# EAGLE design rc28c64rom (EAGLE 9.6.2)
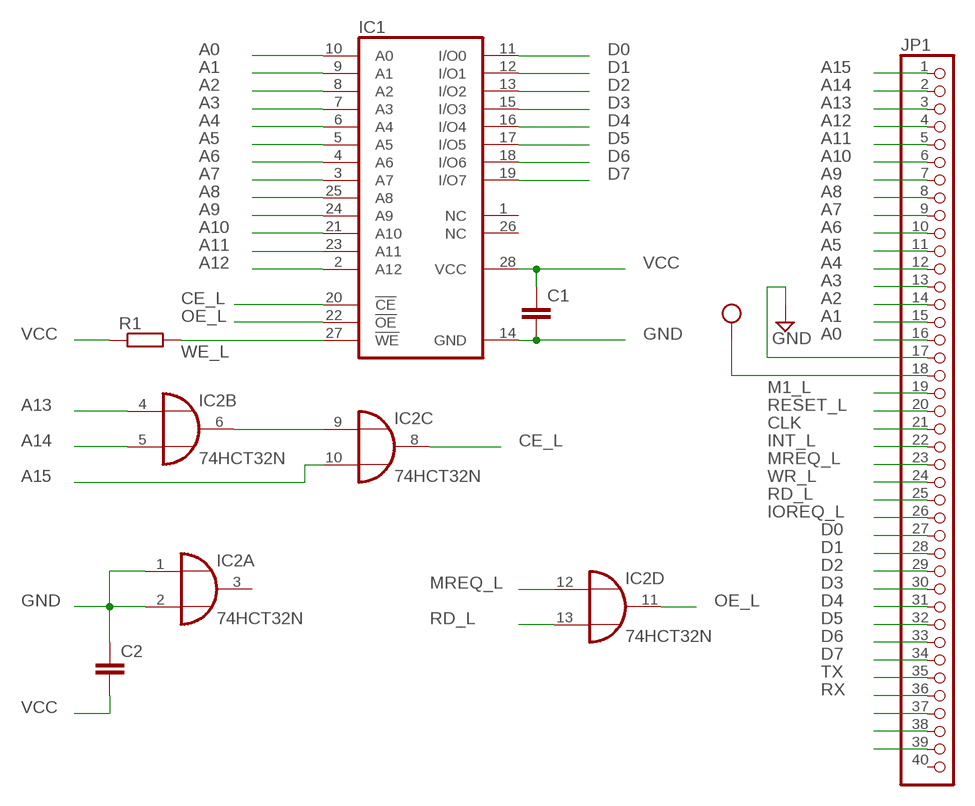
[diagram p0: schematic, sheet 1]

## Parts
C1  C-EU025-025X050  [C025-025X050]
C2  C-EU025-025X050  [C025-025X050]
IC1  28C64C  [DIL28-6]
IC2  74HCT32N  [DIL14]
JP1  PINHD-1X40  [1X40]
R1  R-EU_0204/7  [0204/7]

## Nets
A0: IC1.10(A0) JP1.16
A1: IC1.9(A1) JP1.15
A2: IC1.8(A2) JP1.14
A3: IC1.7(A3) JP1.13
A4: IC1.6(A4) JP1.12
A5: IC1.5(A5) JP1.11
A6: IC1.4(A6) JP1.10
A7: IC1.3(A7) JP1.9
A8: IC1.25(A8) JP1.8
A9: IC1.24(A9) JP1.7
A10: IC1.21(A10) JP1.6
A11: IC1.23(A11) JP1.5
A12: IC1.2(A12) JP1.4
A13: IC2.4(B:I0) JP1.3
A14: IC2.5(B:I1) JP1.2
A15: IC2.10(C:I1) JP1.1
CE_L: IC1.20(!CE) IC2.8(C:O)
CLK: JP1.21
D0: IC1.11(I/O0) JP1.27
D1: IC1.12(I/O1) JP1.28
D2: IC1.13(I/O2) JP1.29
D3: IC1.15(I/O3) JP1.30
D4: IC1.16(I/O4) JP1.31
D5: IC1.17(I/O5) JP1.32
D6: IC1.18(I/O6) JP1.33
D7: IC1.19(I/O7) JP1.34
GND: C1.2 C2.1 IC1.14(GND) IC2.1(A:I0) IC2.2(A:I1) JP1.17
INT_L: JP1.22
IOREQ_L: JP1.26
M1_L: JP1.19
MREQ_L: IC2.12(D:I0) JP1.23
N$1: JP1.37
N$2: JP1.38
N$3: JP1.39
N$4: IC2.6(B:O) IC2.9(C:I0)
OE_L: IC1.22(!OE) IC2.11(D:O)
RD_L: IC2.13(D:I1) JP1.25
RESET_L: JP1.20
RX: JP1.36
TX: JP1.35
VCC: C1.1 C2.2 IC1.28(VCC) JP1.18 R1.1
WE_L: IC1.27(!WE) R1.2
WR_L: JP1.24
Unconnected: IC1.1(NC) IC1.26(NC) IC2.3(A:O) JP1.40

## Power pins joined to a net without a drawn wire
GND: IC2.7(P:GND)
VCC: IC2.14(P:VCC)

## Library data of the parts
C1 C2 = rcl:C-EU: CAPACITOR, European symbol; SPICEPREFIX: C
IC1 = memory-nec:28C64C: MEMORY; MPN: AT28C64B-15PU; OC_FARNELL: 1095784; OC_NEWARK: 96K6557
IC2 = 74xx-eu:74*32: Quad 2-input OR gate
JP1 = pinhead:PINHD-1X40: PIN HEADER
R1 = rcl:R-EU_: RESISTOR, European symbol; SPICEPREFIX: R

## Board
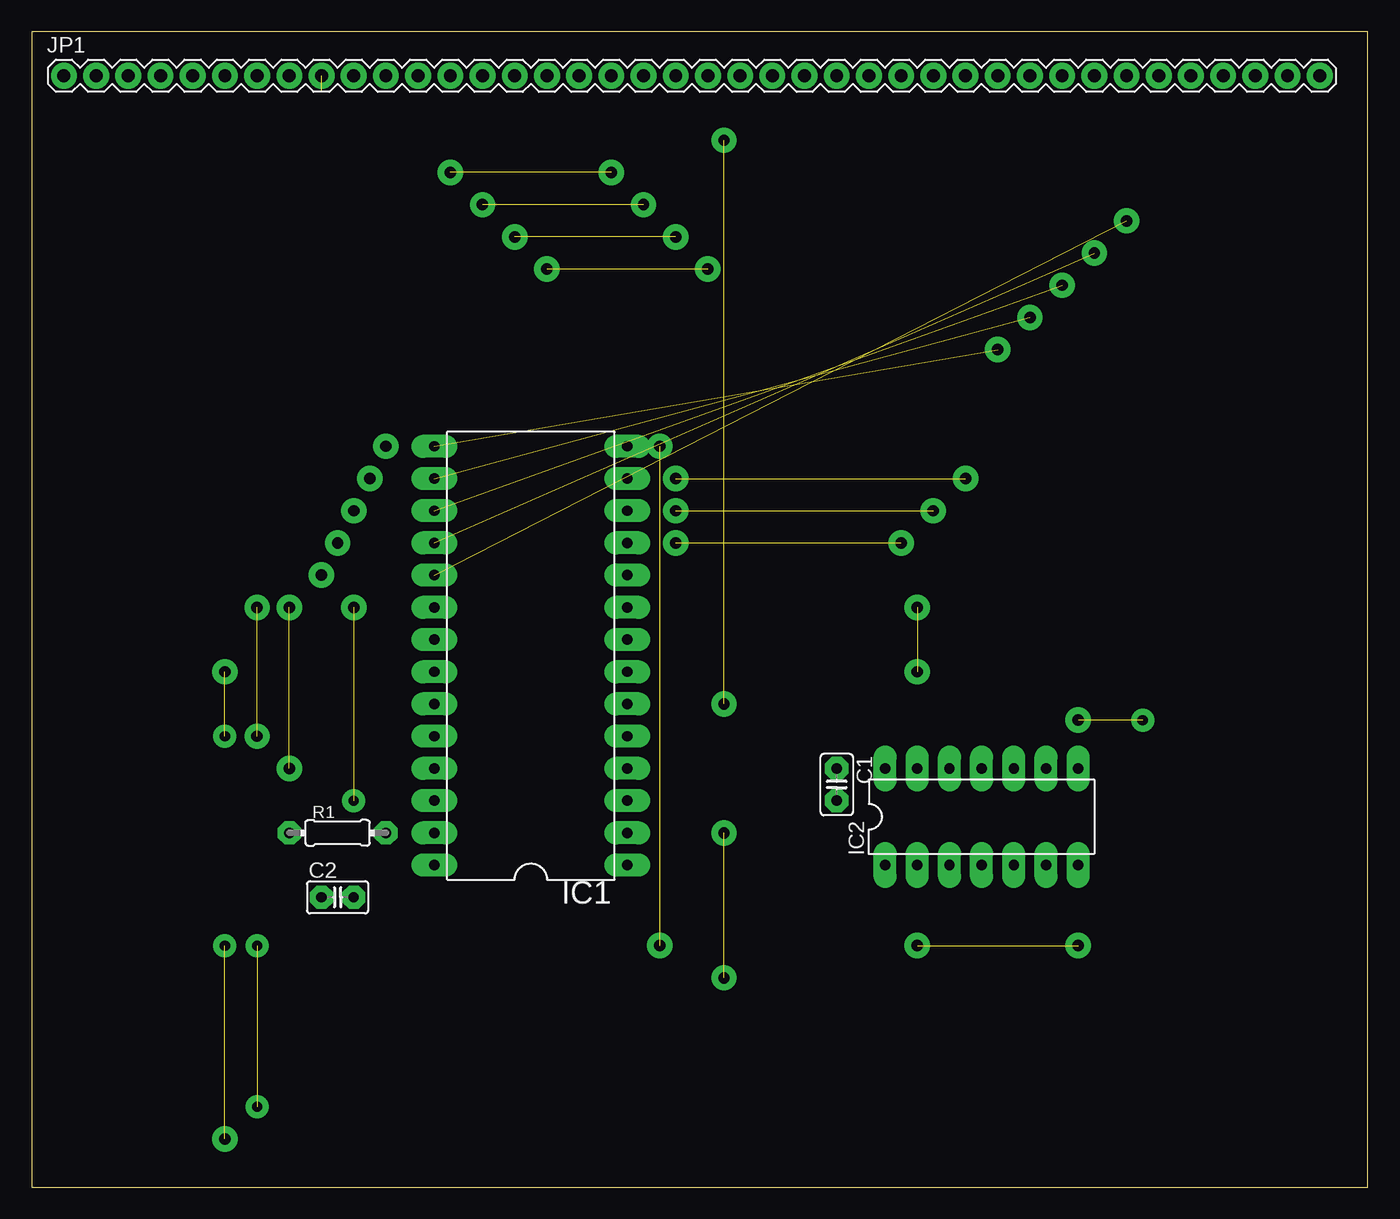
[diagram p1: board, top side]
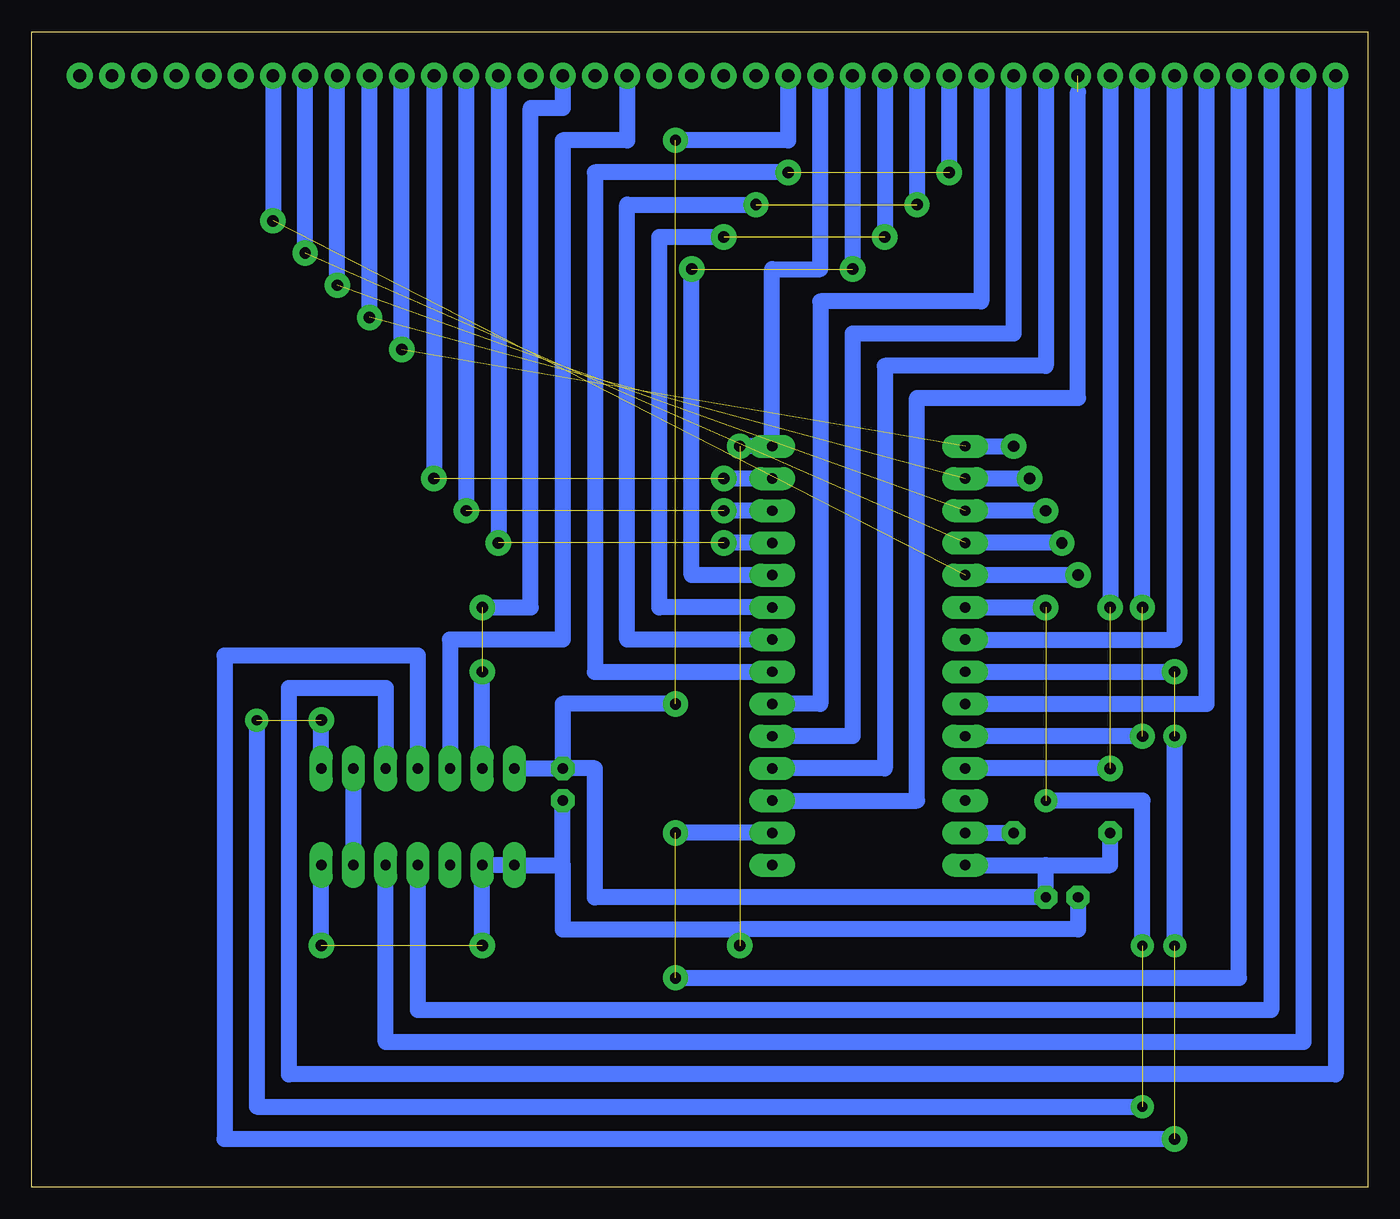
[diagram p2: board, bottom side, seen from below]

Size 105.39 x 91.11 mm. Coordinates in mm from the lower left corner, seen from the top.
Outline: 0,0 105.39,0 105.39,91.11 0,91.11 0,0
Copper layers (1*16): Top 0.035mm / dielectric 1.5mm / Bottom 0.035mm
Design rules "LabE": minimum track width 50mil, minimum drill 0.8mm, track to track 16mil, track to pad 16mil, pad to pad 16mil, via to via 16mil, smd to smd 16mil, copper to edge 0mil, drill to drill 16mil, minimum pad ring 20mil, minimum via ring 20mil, stop-mask expansion 4mil, vias tented up to drill 0mil, thermal gap 10mil

### Footprints (pad centres in the part's own frame; a part is rotated, then mirrored left to right if it is on the bottom)
C025-025X050 = drill 0.813 octagon: 1 -1.27,0; 2 1.27,0
DIL28-6 = drill 0.813 long: 1 -16.51,-7.62; 2 -13.97,-7.62; 3 -11.43,-7.62; 4 -8.89,-7.62; 5 -6.35,-7.62; 6 -3.81,-7.62; 7 -1.27,-7.62; 8 1.27,-7.62; 9 3.81,-7.62; 10 6.35,-7.62; 11 8.89,-7.62; 12 11.43,-7.62; 13 13.97,-7.62; 14 16.51,-7.62; 15 16.51,7.62; 16 13.97,7.62; 17 11.43,7.62; 18 8.89,7.62; 19 6.35,7.62; 20 3.81,7.62; 21 1.27,7.62; 22 -1.27,7.62; 23 -3.81,7.62; 24 -6.35,7.62; 25 -8.89,7.62; 26 -11.43,7.62; 27 -13.97,7.62; 28 -16.51,7.62
DIL14 = drill 0.813 long: 1 -7.62,-3.81; 2 -5.08,-3.81; 3 -2.54,-3.81; 4 0,-3.81; 5 2.54,-3.81; 6 5.08,-3.81; 7 7.62,-3.81; 8 7.62,3.81; 9 5.08,3.81; 10 2.54,3.81; 11 0,3.81; 12 -2.54,3.81; 13 -5.08,3.81; 14 -7.62,3.81
1X40 = drill 1.016: 1 -49.53,0; 2 -46.99,0; 3 -44.45,0; 4 -41.91,0; 5 -39.37,0; 6 -36.83,0; 7 -34.29,0; 8 -31.75,0; 9 -29.21,0; 10 -26.67,0; 11 -24.13,0; 12 -21.59,0; 13 -19.05,0; 14 -16.51,0; 15 -13.97,0; 16 -11.43,0; 17 -8.89,0; 18 -6.35,0; 19 -3.81,0; 20 -1.27,0; 21 1.27,0; 22 3.81,0; 23 6.35,0; 24 8.89,0; 25 11.43,0; 26 13.97,0; 27 16.51,0; 28 19.05,0; 29 21.59,0; 30 24.13,0; 31 26.67,0; 32 29.21,0; 33 31.75,0; 34 34.29,0; 35 36.83,0; 36 39.37,0; 37 41.91,0; 38 44.45,0; 39 46.99,0; 40 49.53,0
0204/7 = drill 0.813 octagon: 1 -3.81,0; 2 3.81,0

### Placement (x,y rotation side)
C1  63.5,31.75 270 top
C2  24.13,22.86 0 top
IC1  39.37,41.91 90 top
IC2  74.93,29.21 0 top
JP1  52.07,87.63 0 top
R1  24.13,27.94 0 top

### Tracks (layer width: path | path; a pad name or v marks a point on that pad's centre or on a via)
A0  (via drill 0.9 pad 2)  (1 unrouted)
  Bottom 1.27: JP1.16 v40.64,72.39 | IC1.10 53.34,48.26 v53.34,72.39
A1  (via drill 0.9 pad 2)  (1 unrouted)
  Bottom 1.27: JP1.15 v38.1,74.93 | IC1.9 55.88,45.72 55.88,74.93 v50.8,74.93
A2  (via drill 0.9 pad 2)  (1 unrouted)
  Bottom 1.27: JP1.14 v35.56,77.47 | IC1.8 58.42,43.18 58.42,77.47 v48.26,77.47
A3  (via drill 0.9 pad 2)  (1 unrouted)
  Bottom 1.27: v33.02,80.01 JP1.13 | v45.72,80.01 60.96,80.01 60.96,40.64 IC1.7
A4
  Bottom 1.27: JP1.12 30.48,69.85 43.18,69.85 43.18,38.1 IC1.6
A5
  Bottom 1.27: JP1.11 27.94,67.31 40.64,67.31 40.64,35.56 IC1.5
A6
  Bottom 1.27: JP1.10 25.4,64.77 38.1,64.77 38.1,33.02 IC1.4
A7  (1 unrouted)
  Bottom 1.27: IC1.3 35.56,30.48 35.56,62.23 22.86,62.23 22.86,86.36
A8  (via drill 0.9 pad 2)  (1 unrouted)
  Bottom 1.27: JP1.8 v20.32,45.72 | v20.32,33.02 IC1.25
A9  (via drill 0.9 pad 2)  (1 unrouted)
  Bottom 1.27: v17.78,45.72 JP1.7 | v17.78,35.56 IC1.24
A10
  Bottom 1.27: JP1.6 15.24,43.18 IC1.21
A11
  Bottom 1.27: JP1.5 12.7,38.1 IC1.23
A12  (via drill 0.9 pad 2)  (1 unrouted)
  Bottom 1.27: JP1.4 10.16,16.51 v54.61,16.51 | IC1.2 v54.61,27.94
A13
  Bottom 1.27: JP1.3 7.62,13.97 74.93,13.97 IC2.4
A14
  Bottom 1.27: JP1.2 5.08,11.43 77.47,11.43 IC2.5
A15
  Bottom 1.27: IC2.10 77.47,39.37 85.09,39.37 85.09,8.89 2.54,8.89 JP1.1
CE_L  (via drill 0.8, 0.9 pad 2)  (3 unrouted)
  Bottom 1.27: IC2.8 v82.55,36.83 | IC1.20 v25.4,45.72 | v87.63,36.83 87.63,6.35 v17.78,6.35 | v17.78,19.05 17.78,30.48 v25.4,30.48
D0  (via drill 0.9 pad 2)  (1 unrouted)
  Bottom 1.27: JP1.27 v68.58,50.8 | IC1.11 v50.8,50.8
D1  (via drill 0.9 pad 2)  (1 unrouted)
  Bottom 1.27: JP1.28 v71.12,53.34 | IC1.12 v50.8,53.34
D2  (via drill 0.9 pad 2)  (1 unrouted)
  Bottom 1.27: JP1.29 v73.66,55.88 | IC1.13 v50.8,55.88
D3  (via drill 0.9 pad 2)  (1 unrouted)
  Bottom 1.27: IC1.15 v27.94,58.42 | v76.2,66.04 JP1.30
D4  (via drill 0.9 pad 2)  (1 unrouted)
  Bottom 1.27: v26.67,55.88 IC1.16 | v78.74,68.58 JP1.31
D5  (via drill 0.9 pad 2)  (1 unrouted)
  Bottom 1.27: v25.4,53.34 IC1.17 | v81.28,71.12 JP1.32
D6  (via drill 0.9 pad 2)  (1 unrouted)
  Bottom 1.27: v24.13,50.8 IC1.18 | v83.82,73.66 JP1.33
D7  (via drill 0.9 pad 2)  (1 unrouted)
  Bottom 1.27: v22.86,48.26 IC1.19 | JP1.34 v86.36,76.2
GND  (via drill 0.9 pad 2)  (2 unrouted)
  Bottom 1.27: C2.1 22.86,20.32 49.53,20.32 | 49.53,20.32 63.5,20.32 63.5,25.4 | JP1.17 43.18,72.39 46.99,72.39 IC1.14 v49.53,58.42 | v69.85,19.05 IC2.2 IC2.1 63.5,25.4 | v82.55,19.05 IC2.7 | v49.53,19.05 49.53,20.32 | 63.5,25.4 C1.2
MREQ_L
  Bottom 1.27: JP1.23 58.42,82.55 63.5,82.55 63.5,43.18 72.39,43.18 IC2.12
N$4
  Bottom 1.27: IC2.6 IC2.9
OE_L  (via drill 0.8, 0.9 pad 2)  (2 unrouted)
  Bottom 1.27: IC1.22 v15.24,40.64 | IC2.11 74.93,41.91 90.17,41.91 90.17,3.81 v15.24,3.81 | v15.24,19.05 v15.24,35.56
RD_L  (via drill 0.9 pad 2)  (1 unrouted)
  Bottom 1.27: JP1.25 63.5,85.09 66.04,85.09 66.04,45.72 v69.85,45.72 | IC2.13 v69.85,40.64
VCC  (via drill 0.9 pad 2)  (1 unrouted)
  Bottom 1.27: R1.1 20.32,25.4 25.4,25.4 | IC2.14 C1.1 | IC1.28 25.4,25.4 | 25.4,25.4 C2.2 60.96,22.86 60.96,33.02 C1.1 | JP1.18 45.72,82.55 v54.61,82.55 | v54.61,38.1 63.5,38.1 C1.1
WE_L
  Bottom 1.27: IC1.27 R1.2